# Altium project STM32Shield.PrjPcb
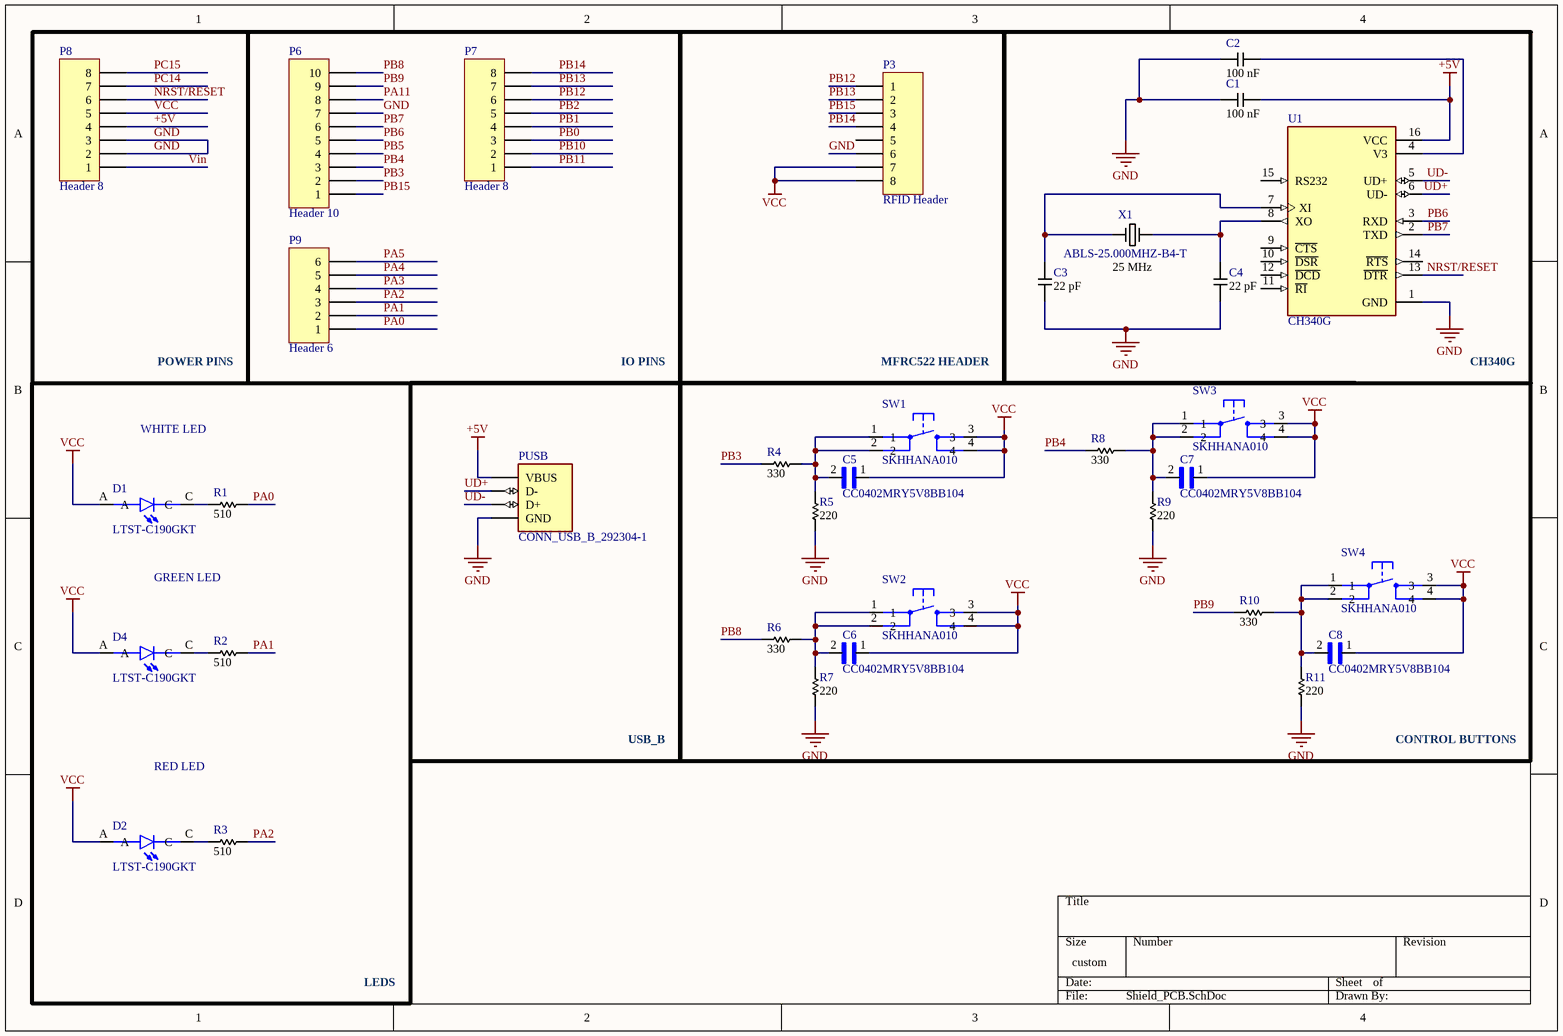
[diagram p0: Shield_PCB.SchDoc]
Designed By: Burak Kaan Şahin; Drawn By: Burak Kaan Şahin; Project: STM32F103 RFID Shield
1 sheet, 34 parts. Net scope: global (net labels, ports and power ports of the same name join across sheets).
Board file: Shield_PCB.PcbDoc

## Sheet Shield_PCB.SchDoc
size 292 x 193 mm; Date: 31.03.2022; DrawnBy: Burak Kaan Şahin; Organization: Dumlupınar Üniversitesi; SheetNumber: 1; SheetTotal: 1

### Parts
C1  Capacitance: 100 nF  [SAMSUNG_CAP_0603_090]  (hidden comment: CL10B222KB8NNNC)
C2  Capacitance: 100 nF  [SAMSUNG_CAP_0603_090]  (hidden comment: CL10B222KB8NNNC)
C3  Capacitance: 22 pF  [SAMSUNG_CAP_0603_090]  (hidden comment: CL10B222KB8NNNC)
C4  Capacitance: 22 pF  [SAMSUNG_CAP_0603_090]  (hidden comment: CL10B222KB8NNNC)
C5  CC0402MRY5V8BB104  [CAPC1005X55N]
C6  CC0402MRY5V8BB104  [CAPC1005X55N]
C7  CC0402MRY5V8BB104  [CAPC1005X55N]
C8  CC0402MRY5V8BB104  [CAPC1005X55N]
D1  LTST-C190GKT  [LEDM1608X80]
D2  LTST-C190GKT  [LEDM1608X80]
D4  LTST-C190GKT  [LEDM1608X80]
P3  RFID Header  [HDR1X8]
P6  Header 10  [HDR1X10]
P7  Header 8  [HDR1X8]
P8  Header 8  [HDR1X8]
P9  Header 6  [HDR1X6]
PUSB  CONN_USB_B_292304-1  [TE_292304-1]
R1  Resistance: 510  [ROYALOHM_RES_0603]  (hidden comment: 0603SAJ0331T5E)
R2  Resistance: 510  [ROYALOHM_RES_0603]  (hidden comment: 0603SAJ0331T5E)
R3  Resistance: 510  [ROYALOHM_RES_0603]  (hidden comment: 0603SAJ0331T5E)
R4  Resistance: 330  [ROYALOHM_RES_0603]  (hidden comment: 0603SAJ0331T5E)
R5  Resistance: 220  [ROYALOHM_RES_0603]  (hidden comment: 0603SAJ0331T5E)
R6  Resistance: 330  [ROYALOHM_RES_0603]  (hidden comment: 0603SAJ0331T5E)
R7  Resistance: 220  [ROYALOHM_RES_0603]  (hidden comment: 0603SAJ0331T5E)
R8  Resistance: 330  [ROYALOHM_RES_0603]  (hidden comment: 0603SAJ0331T5E)
R9  Resistance: 220  [ROYALOHM_RES_0603]  (hidden comment: 0603SAJ0331T5E)
R10  Resistance: 330  [ROYALOHM_RES_0603]  (hidden comment: 0603SAJ0331T5E)
R11  Resistance: 220  [ROYALOHM_RES_0603]  (hidden comment: 0603SAJ0331T5E)
SW1  SKHHANA010  [SW_SKHHANA010]
SW2  SKHHANA010  [SW_SKHHANA010]
SW3  SKHHANA010  [SW_SKHHANA010]
SW4  SKHHANA010  [SW_SKHHANA010]
U1  CH340G  [SOIC127P600X180-16N]
X1  ABLS-25.000MHZ-B4-T  Frequency: 25 MHz  [ABRACON_HC-49/US]

### Blocks framed on the sheet
IO PINS: P6 P7 P9
POWER PINS: P8
MFRC522 HEADER: P3
CH340G: C1-C4 U1 X1

### Nets
+5V: C1.2 P8.4 PUSB.1(VBUS) U1.16(VCC)
GND: C1.1 C2.1 C3.1 C4.1 P3.6 P6.7 P8.2 P8.3 PUSB.4(GND) R5.1 R7.1 R9.1 R11.1 U1.1(GND)
VCC: C5.1 C6.1 C7.1 C8.1 D1.A D2.A D4.A P3.7 P3.8 P8.5 SW1.3 SW1.4 SW2.3 SW2.4 SW3.3 SW3.4 SW4.3 SW4.4
NRST/RESET: P8.6 U1.13(~{DTR})
PA0: P9.1 R1.2
PA1: P9.2 R2.2
PA2: P9.3 R3.2
PA3: P9.4
PA4: P9.5
PA5: P9.6
PA11: P6.8
PB0: P7.3
PB1: P7.4
PB2: P7.5
PB3: P6.2 R4.1
PB4: P6.3 R8.1
PB5: P6.4
PB6: P6.5 U1.3(RXD)
PB7: P6.6 U1.2(TXD)
PB8: P6.10 R6.1
PB9: P6.9 R10.1
PB10: P7.2
PB11: P7.1
PB12: P3.1 P7.6
PB13: P3.2 P7.7
PB14: P3.4 P7.8
PB15: P3.3 P6.1
PC14: P8.7
PC15: P8.8
UD+: PUSB.2(D-) U1.6(UD-)
UD-: PUSB.3(D+) U1.5(UD+)
Vin: P8.1
NetC2_2: C2.2 U1.4(V3)
NetC3_2: C3.2 U1.7(XI) X1.1
NetC4_2: C4.2 U1.8(XO) X1.2
NetC5_2: C5.2 R4.2 R5.2 SW1.1 SW1.2
NetC6_2: C6.2 R6.2 R7.2 SW2.1 SW2.2
NetC7_2: C7.2 R8.2 R9.2 SW3.1 SW3.2
NetC8_2: C8.2 R10.2 R11.2 SW4.1 SW4.2
NetD1_C: D1.C R1.1
NetD2_C: D2.C R3.1
NetD4_C: D4.C R2.1

Not connected (* = marked no-connect by the designer): P3 5; U1 9(~{CTS}) 10(~{DSR}) 11(~{RI}) 12(~{DCD}) 14(~{RTS}) 15(RS232)

### Notes on the sheet
- WHITE LED
- GREEN LED
- RED LED
- USB_B
- CONTROL BUTTONS
- LEDS

### Library data of the parts
C1-C4 = CL10B222KB8NNNC: CAP CER 2200PF 50V X7R 0603; Manufacturer: Samsung Electro-Mechanics; Tolerance: ±10%; Supplier 1: Digi-Key; Supplier 2: Farnell; Supplier 3: Mouser; Supplier 4: Arrow Electronics; Supplier Part Number 1: 1276-1110-1-ND; Supplier Part Number 2: 3013424; Supplier Part Number 3: 187-CL10B222KB8NNNC; Supplier Part Number 4: CL10B222KB8NNNC; Part Number: CL10B222KB8NNNC; Series: CL; Package: Tape & Reel (TR); Voltage - Rated: 50 V; Temperature Coefficient: X7R; Operating Temperature: -55°C ~ 125°C; Features: -; Ratings: -; Applications: General Purpose; Mounting Type: Surface Mount, MLCC; Package / Case: 0603 (1608 Metric); Size / Dimension: 0.063" L x 0.031" W (1.60mm x 0.80mm); Height - Seated (Max): -; Thickness (Max): 0.035" (0.90mm); Lead Spacing: -; Lead Style: -; Ozdisan Link: https://ozdisan.com/pasif-komponentler/kondansatorler/smt-smd-ve-mlcc-kondansatorler/CL10B222KB8NNNC; Digikey Link: https://www.digikey.com/en/products/detail/samsung-electro-mechanics/CL10B222KB8NNNC/3886768?s=N4IgTCBcDaIMIBkCMAGAQmTBpNAOAcoXCALoC%2BQA; Farnell Link: https://tr.farnell.com/samsung-electro-mechanics/cl10b222kb8nnnc/cap-2200pf-50v-mlcc-0603/dp/3013424?st=cl10b222kb8nnnc; Mouser Link: https://www.mouser.com.tr/ProductDetail/Samsung-Electro-Mechanics/CL10B222KB8NNNC?qs=%2Fha2pyFaduiYAieMNAGY%2Fbybcsm2neKaXkwr9Z%2FZUBvjhuhemCiTrg%3D%3D
C5-C8 = CC0402MRY5V8BB104: CAP CER 0.1UF 25V Y5V 0402; Package: None; Price: None; Value: *; MP: CC0402MRY5V8BB104; Availability: Unavailable
D1 D2 D4 = LTST-C190GKT: Green 569nm LED Indication - Discrete 2.1V 0603 (1608 Metric); MF: Lite-On Inc.; DigiKey-Purchase-URL: https://snapeda.com/shop?store=DigiKey&id=46935; Package: 0603 Lite-On; Value: *; Digi-Key_Part_Number: 160-1183-1-ND; SnapEDA_Link: https://www.snapeda.com/parts/LTST-C190GKT/Lite-On%20Inc./view-part/46935/?ref=snap; MP: LTST-C190GKT
P3 P7 P8 = Header 8: Header, 8-Pin; LatestRevisionDate: 17-Jul-2002; LatestRevisionNote: Re-released for DXP Platform.; Publisher: Altium Limited
P6 = Header 10: Header, 10-Pin; LatestRevisionDate: 17-Jul-2002; LatestRevisionNote: Re-released for DXP Platform.; Publisher: Altium Limited
P9 = Header 6: Header, 6-Pin; LatestRevisionDate: 17-Jul-2002; LatestRevisionNote: Re-released for DXP Platform.; Publisher: Altium Limited
PUSB = 292304-1: USB-B _USB TYPE-B_ USB 2.0 Receptacle Connector 4 Position Through Hole, Right Angle; MF: TE Connectivity; Number_of_Positions: 4; Centerline_Pitch: 2.5 mm[.098 in]; Package: None; Product_Type: Connector; Value: *; TE_purchase_URL: https://www.te.com/usa-en/product-292304-1.html?te_bu=Cor&te_type=disp&te_campaign=seda_glo_cor-seda-global-disp-prtnr-fy19-seda-model-bom-cta_sma-317_1&elqCampaignId=32493; Price: None; MP: 292304-1; SnapEDA_Link: https://www.snapeda.com/parts/292304-1/TE%20Connectivity%20AMP%20Connectors/view-part/585812/?ref=snap; Availability: Unavailable; EU_RoHS_Compliance: Compliant
R1-R11 = 0603SAJ0331T5E: RES SMD 510R OHM 5% 1/10W 0603; Manufacturer: Royalohm; Power (Watts): 0.1 W, 1/10 W; Temperature Coefficient: ±100 ppm/°C; Part Number: 0603SAJ0331T5E; Series: -; Package: Tape & Reel (TR); Tolerance: ±5%; Composition: Thick Film; Features: General Purpose; Operating Temperature: -55°C ~ 155°C; Ratings: -; Package / Case: 0603 (1608 Metric); Supplier Device Package: 0603; Size / Dimension: 0.063" L x 0.031" W (1.60mm x 0.80mm); Height - Seated (Max): 0.022" (0.55mm); Number of Terminations: 2; Failure Rate: -; Ozdisan Link: https://ozdisan.com/pasif-komponentler/direncler/smt-smd-ve-cip-direncler/0603SAJ0331T5E; Digikey Link: -; Farnell Link: -; Mouser Link: -
SW1-SW4 = SKHHANA010: Switch Tactile N.O. SPST Round Button PC Pins 0.05A 12VDC 0.98N Thru-Hole Bulk; MF: ALPS; Value: *; SnapEDA_Link: https://www.snapeda.com/parts/SKHHANA010/ALPS/view-part/248805/?ref=snap; Price: None; Availability: Unavailable; Package: None; MP: SKHHANA010
U1 = CH340G: USB Interface Integrated Circuit; MF: WCH; Price: None; SnapEDA_Link: https://www.snapeda.com/parts/Ch340G/WCH/view-part/?ref=snap; MP: Ch340G; Value: *; Availability: Not in stock; Package: None; Check_prices: https://www.snapeda.com/parts/Ch340G/WCH/view-part/?ref=eda
X1 = ABLS-8.000MHZ-B4-T: CRYSTAL 8.0000MHZ 18PF SMD; Manufacturer: Abracon LLC; Frequency Stability: ±50 ppm; Frequency Tolerance: ±30 ppm; ESR (Equivalent Series Resistance): 80 Ohms; Operating Mode: Fundamental; Supplier 1: Digi-Key; Supplier 2: Farnell; Supplier 3: Mouser; Supplier 4: Arrow Electronics; Supplier Part Number 1: 535-10212-1-ND; Supplier Part Number 2: 2467757; Supplier Part Number 3: 815-ABLS-8.0M-T; Supplier Part Number 4: ABLS-8.000MHZ-B4-T; Part Number: ABLS-8.000MHZ-B4-T; Series: ABLS; Package: Tape & Reel (TR); Type: MHz Crystal; Load Capacitance: 18 pF; Operating Temperature: -20°C ~ 70°C; Ratings: -; Mounting Type: Surface Mount; Package / Case: HC-49/US; Size / Dimension: 0.449" L x 0.185" W (11.40mm x 4.70mm); Height - Seated (Max): 0.165" (4.20mm); Ozdisan Link: https://ozdisan.com/pasif-komponentler/kristaller-osilatorler-ve-rezanatorler/kristaller/ABLS-8-000MHZ-B4-T; Digikey Link: https://www.digikey.com/en/products/detail/abracon-llc/ABLS-8-000MHZ-B4-T/2184155?s=N4IgTCBcDaIIICEAyBlAtADgHQAY8FkAJALTQQBY0AVEAXQF8g; Farnell Link: https://tr.farnell.com/abracon/abls-8-000mhz-b4-t/crystal-8mhz-18pf-hc-49us/dp/2467757?st=abls-8.000mhz-b4-t; Mouser Link: https://www.mouser.com.tr/ProductDetail/ABRACON/ABLS-8000MHZ-B4-T?qs=%2Fha2pyFadug9a307lIAi6Clp1F%252BGEpwfWRmDaTuihuzHm6%252BPPduuWg%3D%3D